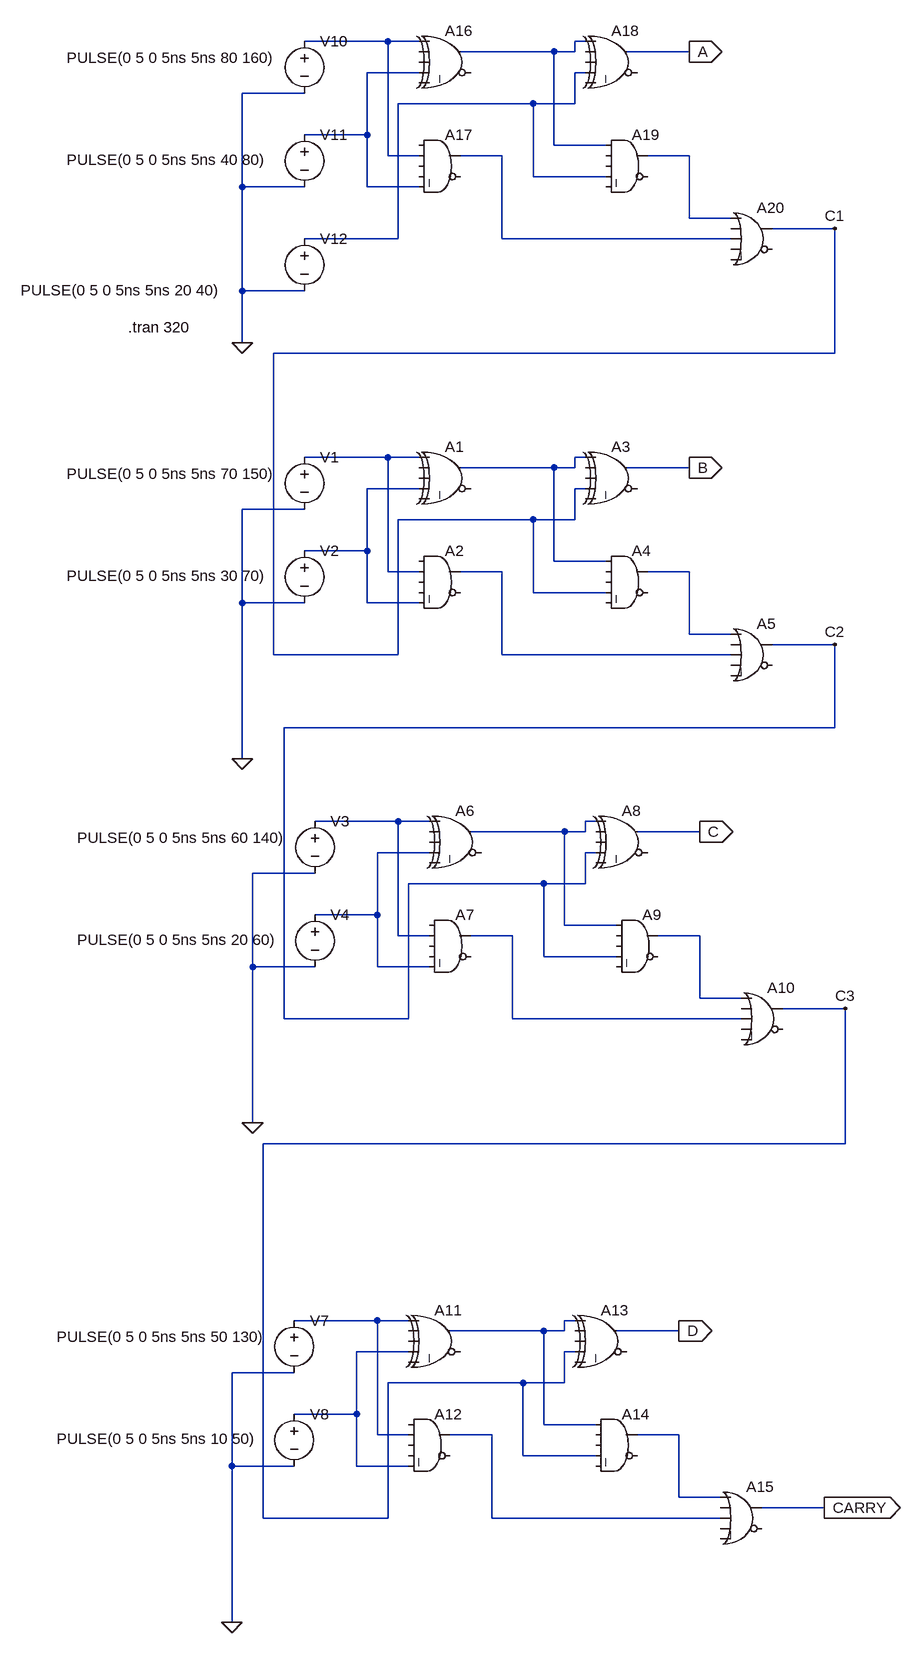
[diagram p0: schematic 4-bits-Full_Adder.asc]
4-bits-Full_Adder.asc, the LTspice schematic file:
Version 4
SHEET 1 1036 1908
WIRE 160 -544 32 -544
WIRE 208 -544 160 -544
WIRE 464 -544 448 -544
WIRE 416 -528 272 -528
WIRE 448 -528 448 -544
WIRE 448 -528 416 -528
WIRE 624 -528 528 -528
WIRE 208 -496 128 -496
WIRE 464 -496 448 -496
WIRE 32 -464 -64 -464
WIRE 384 -448 176 -448
WIRE 448 -448 448 -496
WIRE 448 -448 384 -448
WIRE 128 -400 128 -496
WIRE 128 -400 32 -400
WIRE 416 -384 416 -528
WIRE 496 -384 416 -384
WIRE 160 -368 160 -544
WIRE 208 -368 160 -368
WIRE 336 -368 272 -368
WIRE 624 -368 560 -368
WIRE 384 -336 384 -448
WIRE 496 -336 384 -336
WIRE -64 -320 -64 -464
WIRE 32 -320 -64 -320
WIRE 128 -320 128 -400
WIRE 208 -320 128 -320
WIRE 624 -272 624 -368
WIRE 688 -272 624 -272
WIRE 848 -256 752 -256
WIRE 176 -240 176 -448
WIRE 176 -240 32 -240
WIRE 336 -240 336 -368
WIRE 688 -240 336 -240
WIRE -64 -160 -64 -320
WIRE 32 -160 -64 -160
WIRE -64 -80 -64 -160
WIRE 848 -64 848 -256
WIRE 848 -64 -16 -64
WIRE 160 96 32 96
WIRE 208 96 160 96
WIRE 464 96 448 96
WIRE 416 112 272 112
WIRE 448 112 448 96
WIRE 448 112 416 112
WIRE 624 112 528 112
WIRE 208 144 128 144
WIRE 464 144 448 144
WIRE 32 176 -64 176
WIRE 384 192 176 192
WIRE 448 192 448 144
WIRE 448 192 384 192
WIRE 128 240 128 144
WIRE 128 240 32 240
WIRE 416 256 416 112
WIRE 496 256 416 256
WIRE 160 272 160 96
WIRE 208 272 160 272
WIRE 336 272 272 272
WIRE 624 272 560 272
WIRE 384 304 384 192
WIRE 496 304 384 304
WIRE -64 320 -64 176
WIRE 32 320 -64 320
WIRE 128 320 128 240
WIRE 208 320 128 320
WIRE 624 368 624 272
WIRE 688 368 624 368
WIRE 848 384 752 384
WIRE -16 400 -16 -64
WIRE 176 400 176 192
WIRE 176 400 -16 400
WIRE 336 400 336 272
WIRE 688 400 336 400
WIRE 848 512 848 384
WIRE 848 512 0 512
WIRE -64 560 -64 320
WIRE 176 656 48 656
WIRE 224 656 176 656
WIRE 480 656 464 656
WIRE 432 672 288 672
WIRE 464 672 464 656
WIRE 464 672 432 672
WIRE 640 672 544 672
WIRE 224 704 144 704
WIRE 480 704 464 704
WIRE 48 736 -48 736
WIRE 400 752 192 752
WIRE 464 752 464 704
WIRE 464 752 400 752
WIRE 144 800 144 704
WIRE 144 800 48 800
WIRE 432 816 432 672
WIRE 512 816 432 816
WIRE 176 832 176 656
WIRE 224 832 176 832
WIRE 352 832 288 832
WIRE 640 832 576 832
WIRE 400 864 400 752
WIRE 512 864 400 864
WIRE -48 880 -48 736
WIRE 48 880 -48 880
WIRE 144 880 144 800
WIRE 224 880 144 880
WIRE 640 928 640 832
WIRE 704 928 640 928
WIRE 864 944 768 944
WIRE 0 960 0 512
WIRE 192 960 192 752
WIRE 192 960 0 960
WIRE 352 960 352 832
WIRE 704 960 352 960
WIRE -48 1120 -48 880
WIRE 864 1152 864 944
WIRE 864 1152 -32 1152
WIRE 144 1424 16 1424
WIRE 192 1424 144 1424
WIRE 448 1424 432 1424
WIRE 400 1440 256 1440
WIRE 432 1440 432 1424
WIRE 432 1440 400 1440
WIRE 608 1440 512 1440
WIRE 192 1472 112 1472
WIRE 448 1472 432 1472
WIRE 16 1504 -80 1504
WIRE 368 1520 160 1520
WIRE 432 1520 432 1472
WIRE 432 1520 368 1520
WIRE 112 1568 112 1472
WIRE 112 1568 16 1568
WIRE 400 1584 400 1440
WIRE 480 1584 400 1584
WIRE 144 1600 144 1424
WIRE 192 1600 144 1600
WIRE 320 1600 256 1600
WIRE 608 1600 544 1600
WIRE 368 1632 368 1520
WIRE 480 1632 368 1632
WIRE -80 1648 -80 1504
WIRE 16 1648 -80 1648
WIRE 112 1648 112 1568
WIRE 192 1648 112 1648
WIRE 608 1696 608 1600
WIRE 672 1696 608 1696
WIRE 832 1712 736 1712
WIRE -32 1728 -32 1152
WIRE 160 1728 160 1520
WIRE 160 1728 -32 1728
WIRE 320 1728 320 1600
WIRE 672 1728 320 1728
WIRE -80 1888 -80 1648
FLAG -64 560 0
FLAG 624 112 B
IOPIN 624 112 Out
FLAG 848 384 C2
FLAG -80 1888 0
FLAG 608 1440 D
IOPIN 608 1440 Out
FLAG 832 1712 CARRY
IOPIN 832 1712 Out
FLAG -64 -80 0
FLAG 624 -528 A
IOPIN 624 -528 Out
FLAG 848 -256 C1
FLAG -48 1120 0
FLAG 640 672 C
IOPIN 640 672 Out
FLAG 864 944 C3
SYMBOL voltage 32 80 R0
WINDOW 3 -366 41 Left 2
WINDOW 123 0 0 Left 0
WINDOW 39 0 0 Left 0
SYMATTR InstName V1
SYMATTR Value PULSE(0 5 0 5ns 5ns 70 150)
SYMBOL voltage 32 224 R0
WINDOW 3 -366 54 Left 2
WINDOW 123 0 0 Left 0
WINDOW 39 0 0 Left 0
SYMATTR InstName V2
SYMATTR Value PULSE(0 5 0 5ns 5ns 30 70)
SYMBOL Digital\\xor 256 64 R0
SYMATTR InstName A1
SYMBOL Digital\\and 240 224 R0
SYMATTR InstName A2
SYMBOL Digital\\xor 512 64 R0
SYMATTR InstName A3
SYMBOL Digital\\and 528 224 R0
SYMATTR InstName A4
SYMBOL Digital\\or 720 336 R0
SYMATTR InstName A5
SYMBOL voltage 16 1408 R0
WINDOW 3 -366 41 Left 2
WINDOW 123 0 0 Left 0
WINDOW 39 0 0 Left 0
SYMATTR InstName V7
SYMATTR Value PULSE(0 5 0 5ns 5ns 50 130)
SYMBOL voltage 16 1552 R0
WINDOW 3 -366 54 Left 2
WINDOW 123 0 0 Left 0
WINDOW 39 0 0 Left 0
SYMATTR InstName V8
SYMATTR Value PULSE(0 5 0 5ns 5ns 10 50)
SYMBOL Digital\\xor 240 1392 R0
SYMATTR InstName A11
SYMBOL Digital\\and 224 1552 R0
SYMATTR InstName A12
SYMBOL Digital\\xor 496 1392 R0
SYMATTR InstName A13
SYMBOL Digital\\and 512 1552 R0
SYMATTR InstName A14
SYMBOL Digital\\or 704 1664 R0
SYMATTR InstName A15
SYMBOL voltage 32 -560 R0
WINDOW 3 -366 41 Left 2
WINDOW 123 0 0 Left 0
WINDOW 39 0 0 Left 0
SYMATTR InstName V10
SYMATTR Value PULSE(0 5 0 5ns 5ns 80 160)
SYMBOL voltage 32 -416 R0
WINDOW 3 -366 54 Left 2
WINDOW 123 0 0 Left 0
WINDOW 39 0 0 Left 0
SYMATTR InstName V11
SYMATTR Value PULSE(0 5 0 5ns 5ns 40 80)
SYMBOL Digital\\xor 256 -576 R0
SYMATTR InstName A16
SYMBOL Digital\\and 240 -416 R0
SYMATTR InstName A17
SYMBOL Digital\\xor 512 -576 R0
SYMATTR InstName A18
SYMBOL Digital\\and 528 -416 R0
SYMATTR InstName A19
SYMBOL voltage 32 -256 R0
WINDOW 3 -437 95 Left 2
WINDOW 123 0 0 Left 0
WINDOW 39 0 0 Left 0
SYMATTR InstName V12
SYMATTR Value PULSE(0 5 0 5ns 5ns 20 40)
SYMBOL Digital\\or 720 -304 R0
SYMATTR InstName A20
SYMBOL voltage 48 640 R0
WINDOW 3 -366 41 Left 2
WINDOW 123 0 0 Left 0
WINDOW 39 0 0 Left 0
SYMATTR InstName V3
SYMATTR Value PULSE(0 5 0 5ns 5ns 60 140)
SYMBOL voltage 48 784 R0
WINDOW 3 -366 54 Left 2
WINDOW 123 0 0 Left 0
WINDOW 39 0 0 Left 0
SYMATTR InstName V4
SYMATTR Value PULSE(0 5 0 5ns 5ns 20 60)
SYMBOL Digital\\xor 272 624 R0
SYMATTR InstName A6
SYMBOL Digital\\and 256 784 R0
SYMATTR InstName A7
SYMBOL Digital\\xor 528 624 R0
SYMATTR InstName A8
SYMBOL Digital\\and 544 784 R0
SYMATTR InstName A9
SYMBOL Digital\\or 736 896 R0
SYMATTR InstName A10
TEXT -240 -104 Left 2 !.tran 320

The netlist it stands for:
* 4-bits-Full_Adder.asc
V1 N007 0 PULSE(0 5 0 5ns 5ns 70 150)
V2 N009 0 PULSE(0 5 0 5ns 5ns 30 70)
A1 N007 0 0 N009 0 0 N008 0 XOR
A2 0 N007 0 0 N009 0 N010 0 AND
A3 N008 0 0 C1 0 0 B 0 XOR
A4 N008 0 0 C1 0 0 N011 0 AND
A5 N011 0 N010 0 0 0 C2 0 OR
V7 N017 0 PULSE(0 5 0 5ns 5ns 50 130)
V8 N019 0 PULSE(0 5 0 5ns 5ns 10 50)
A11 N017 0 0 N019 0 0 N018 0 XOR
A12 0 N017 0 0 N019 0 N020 0 AND
A13 N018 0 0 C3 0 0 D 0 XOR
A14 N018 0 0 C3 0 0 N021 0 AND
A15 N021 0 N020 0 0 0 CARRY 0 OR
V10 N001 0 PULSE(0 5 0 5ns 5ns 80 160)
V11 N003 0 PULSE(0 5 0 5ns 5ns 40 80)
A16 N001 0 0 N003 0 0 N002 0 XOR
A17 0 N001 0 0 N003 0 N005 0 AND
A18 N002 0 0 N004 0 0 A 0 XOR
A19 N002 0 0 N004 0 0 N006 0 AND
V12 N004 0 PULSE(0 5 0 5ns 5ns 20 40)
A20 N006 0 N005 0 0 0 C1 0 OR
V3 N012 0 PULSE(0 5 0 5ns 5ns 60 140)
V4 N014 0 PULSE(0 5 0 5ns 5ns 20 60)
A6 N012 0 0 N014 0 0 N013 0 XOR
A7 0 N012 0 0 N014 0 N015 0 AND
A8 N013 0 0 C2 0 0 C 0 XOR
A9 N013 0 0 C2 0 0 N016 0 AND
A10 N016 0 N015 0 0 0 C3 0 OR
.tran 320
.backanno
.end